# Altium schematic sheet DCDC.SchDoc
size A4; SheetNumber: 5; SheetTotal: 13
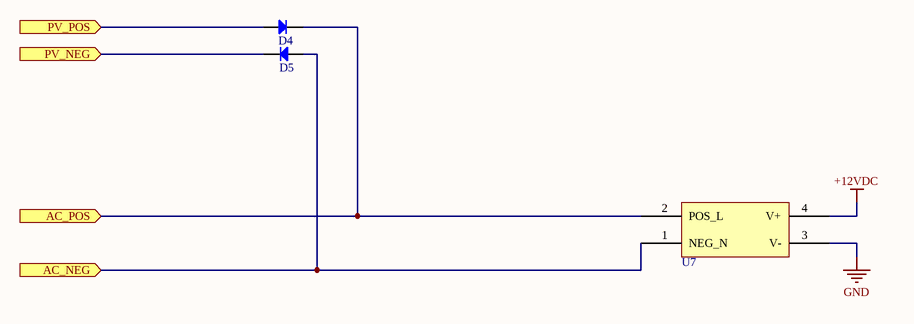
[diagram p0: DCDC.SchDoc]

## Parts
D4  S3G-13-F  [SMC DO-214AB]  (value not drawn)
D5  S3G-13-F  [SMC DO-214AB]  (value not drawn)
U7  EPS-25-12  [EPS-25-12]  (value not drawn)

## Ports
AC_NEG (in), AC_POS (in), PV_NEG (in), PV_POS (in)

## Nets
+12VDC: U7.4(V+)
GND: U7.3(V-)
AC_NEG: D5.A U7.1(NEG_N) ; port AC_NEG
AC_POS: D4.K U7.2(POS_L) ; port AC_POS
PV_NEG: D5.K ; port PV_NEG
PV_POS: D4.A ; port PV_POS

## Library data of the parts
D4 D5 = 1047-0014: DIODE GEN PURP 400V 3A SMC; Manufacturer: Diodes Incorporated; Current: A; Voltage: V; id: 459057; inventory_price: 0.4; x_Capacitance: Not Applicable; x_Link_Description: Datasheet; x_port_to_unleashed: No; Supplier 1: Digi-Key; Supplier Part Number 1: CUS10S30H3FTR-ND; Manufacturer Part Number: S3G-13-F; Mount: SMT; ComponentLink1URL: https://toshiba.semicon-storage.com/info/docget.jsp?did=14077&prodName=CUS10S30; ComponentLink1Description: Datasheet; partnumber: 1047-0014; created_on: 21/02/2022 8:49:25 PM; parttype: Diodes - Rectifiers - Single; rohs: 1; updated_on: 21/02/2022 9:00:39 PM; x_current: Not Applicable; x_inductance: Not Applicable; x_Link_URL: https://www.diodes.com/assets/Datasheets/ds16005.pdf; x_max_temp: N/A; x_min_temp: N/A; x_Power: Not Applicable; x_resistance: Not Applicable; x_temp_coef: Not Applicable; x_Tolerance: Not Applicable; x_Vol: Not Applicable
U7 = 1092-0010: AC/DC CONVERTER 12V 25W; manufacturer: MEAN WELL USA Inc.; id: 467390; inventory_price: 15.52; x_Capacitance: Not Applicable; x_Link_Description: Datasheet; x_max_temp: 70°C (With Derating); x_min_temp: -30°C; x_port_to_unleashed: No; partnumber: 1092-0010; Manufacturer Part Number: EPS-25-12; created_on: 22/04/2022 3:43:51 PM; parttype: AC DC Converters; rohs: 1; updated_on: 22/04/2022 4:03:59 PM; x_current: Not Applicable; x_inductance: Not Applicable; x_Link_URL: https://www.meanwellusa.com/upload/pdf/EPS-25/EPS-25-spec.pdf; x_Power: 25W; x_resistance: Not Applicable; x_temp_coef: Not Applicable; x_Tolerance: Not Applicable; x_Vol: Not Applicable